# Altium schematic sheet Base Board.SchDoc
size A3; : 輸出入介面電路
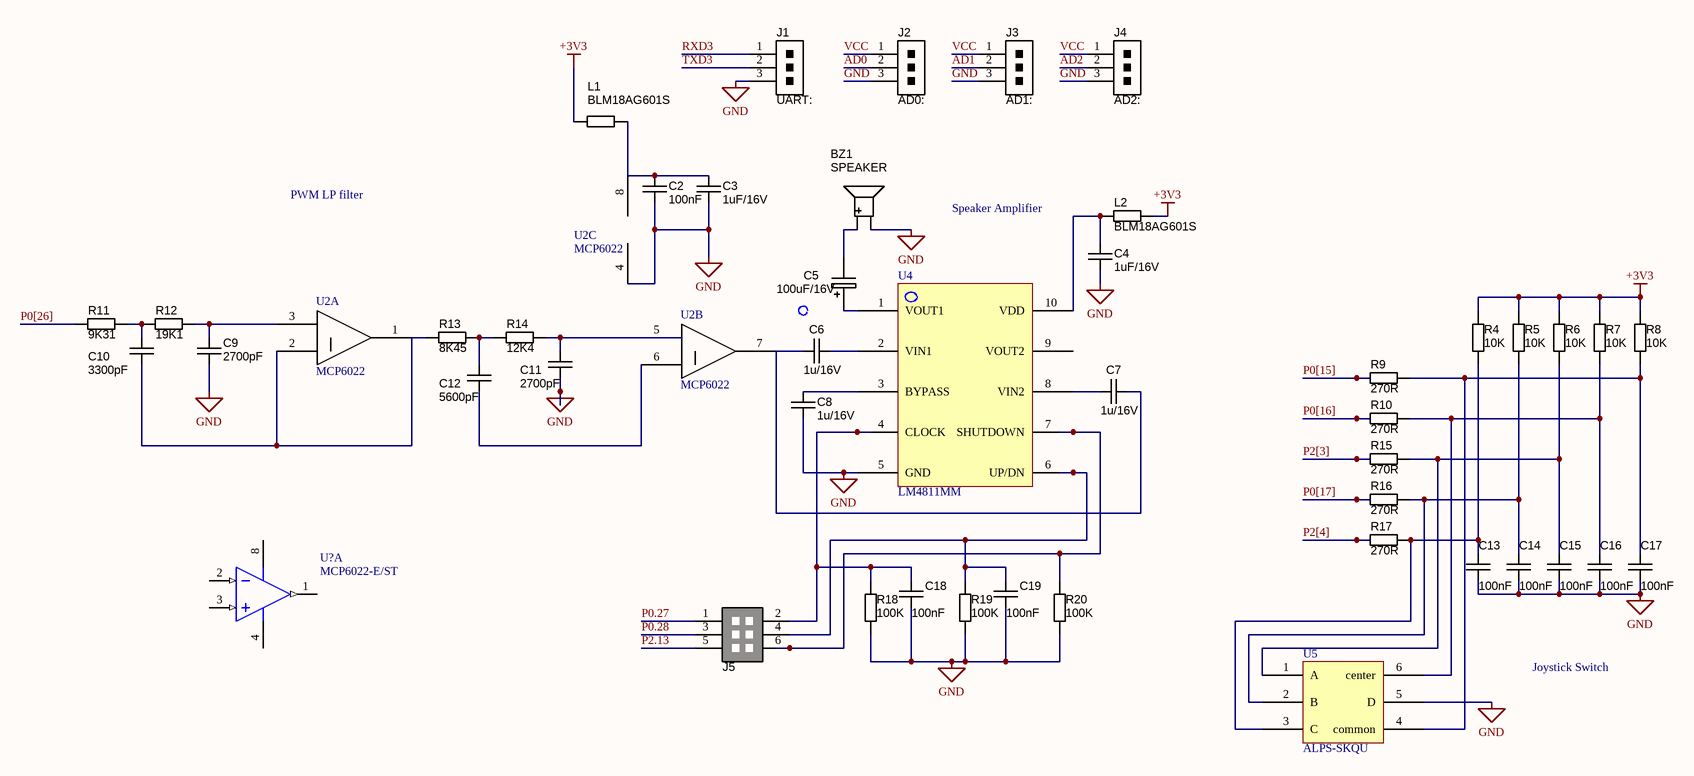
[diagram p0: Base Board.SchDoc]

## Parts
BZ1  Manufacturer Part Number 1: SPEAKER  [BUZZER_12.0X8.5MM]  (hidden comment: Alternate part: 3100-932)
C2  value 100nF  [CAPC2012N]  (hidden comment: approved sub OK)
C3  value 1uF/16V  [CAPC2012N]  (hidden comment: approved sub OK)
C4  value 1uF/16V  [CAPC2012N]  (hidden comment: approved sub OK)
C5  (no value)  [CAPMP3528X210N]
C6  value 1u/16V  [CAPC2012N]  (hidden comment: approved sub OK)
C7  value 1u/16V  [CAPC2012N]  (hidden comment: approved sub OK)
C8  value 1u/16V  [CAPC2012N]  (hidden comment: approved sub OK)
C9  value 2700pF  [CAPC2012N]  (hidden comment: approved sub OK)
C10  value 3300pF  [CAPC2012N]  (hidden comment: approved sub OK)
C11  value 2700pF  [CAPC2012N]  (hidden comment: approved sub OK)
C12  value 5600pF  [CAPC2012N]  (hidden comment: approved sub OK)
C13  value 100nF  [CAPC2012N]  (hidden comment: approved sub OK)
C14  value 100nF  [CAPC2012N]  (hidden comment: approved sub OK)
C15  value 100nF  [CAPC2012N]  (hidden comment: approved sub OK)
C16  value 100nF  [CAPC2012N]  (hidden comment: approved sub OK)
C17  value 100nF  [CAPC2012N]  (hidden comment: approved sub OK)
C18  value 100nF  [CAPC2012N]  (hidden comment: approved sub OK)
C19  value 100nF  [CAPC2012N]  (hidden comment: approved sub OK)
J1  CONN_HEADER_1x3P_0.100in  [1x3POS_HEADER]  (value not drawn)
J2  CONN_HEADER_1x3P_0.100in  [1x3POS_HEADER]  (value not drawn)
J3  CONN_HEADER_1x3P_0.100in  [1x3POS_HEADER]  (value not drawn)
J4  CONN_HEADER_1x3P_0.100in  [1x3POS_HEADER]  (value not drawn)
J5  micro-match socket  [6P_PCB_SOCKET_BRD_MNT_MICRO-MATCH]  (value not drawn)
L1  value BLM18AG601S  [RESC2012N]  (hidden comment: Thick Film)
L2  value BLM18AG601S  [RESC2012N]  (hidden comment: Thick Film)
R4  value 10K  [RESC2012N]  (hidden comment: Thick Film)
R5  value 10K  [RESC2012N]  (hidden comment: Thick Film)
R6  value 10K  [RESC2012N]  (hidden comment: Thick Film)
R7  value 10K  [RESC2012N]  (hidden comment: Thick Film)
R8  value 10K  [RESC2012N]  (hidden comment: Thick Film)
R9  value 270R  [RESC1005N]  (hidden comment: Thick Film)
R10  value 270R  [RESC1005N]  (hidden comment: Thick Film)
R11  value 9K31  [RESC1005N]  (hidden comment: Thick Film)
R12  value 19K1  [RESC1005N]  (hidden comment: Thick Film)
R13  value 8K45  [RESC1005N]  (hidden comment: Thick Film)
R14  value 12K4  [RESC1005N]  (hidden comment: Thick Film)
R15  value 270R  [RESC1005N]  (hidden comment: Thick Film)
R16  value 270R  [RESC1005N]  (hidden comment: Thick Film)
R17  value 270R  [RESC1005N]  (hidden comment: Thick Film)
R18  value 100K  [RESC1005N]  (hidden comment: Thick Film)
R19  value 100K  [RESC1005N]  (hidden comment: Thick Film)
R20  value 100K  [RESC1005N]  (hidden comment: Thick Film)
U2  MCP6022  [MSOP-UA8_L]  (parts A,B,C of 3)
U4  LM4811MM  [MSOP-UN10_N]
U5  ALPS-SKQU  [SOT-23-CH6_L]
U?  MCP6022-E/ST  [TSSOP-ST8_N]  (part A of 2)

## Nets
+3V3: L1.1 L2.2 R4.1 R5.1 R6.1 R7.1 R8.1
GND: BZ1.2(Negative) C2.1 C3.1 C4.1 C8.1 C9.2 C11.2 C13.2 C14.2 C15.2 C16.2 C17.2 C18.2 C19.2 J1.3 J2.3 J3.3 J4.3 R18.1 R19.1 R20.1 U4.5(GND) U5.5(D)
AD0: J2.2
AD1: J3.2
AD2: J4.2
P0.27: J5.1
P0.28: J5.3
P0[15]: R9.1
P0[16]: R10.1
P0[17]: R16.1
P0[26]: R11.1
P2.13: J5.5
P2[3]: R15.1
P2[4]: R17.1
RXD3: J1.1
TXD3: J1.2
VCC: J2.1 J3.1 J4.1
NetBZ1_1: BZ1.1(Positive) C5.2
NetC2_2: C2.2 C3.2 L1.2
NetC4_2: C4.2 L2.1 U4.10(VDD)
NetC5_1: C5.1 U4.1(VOUT1)
NetC6_1: C6.1 C7.2
NetC6_2: C6.2 U4.2(VIN1)
NetC7_1: C7.1 U4.8(VIN2)
NetC8_2: C8.2 U4.3(BYPASS)
NetC9_1: C9.1 R12.2
NetC10_1: C10.1 R11.2 R12.1
NetC10_2: C10.2 R13.2
NetC11_1: C11.1 R14.2 U2.5(VINB+)
NetC12_1: C12.1 R13.1 R14.1
NetC13_1: C13.1 R4.2 R17.2 U5.3(C)
NetC14_1: C14.1 R5.2 R16.2 U5.2(B)
NetC15_1: C15.1 R6.2 R15.2 U5.1(A)
NetC16_1: C16.1 R7.2 R10.2 U5.6(center)
NetC17_1: C17.1 R8.2 R9.2 U5.4(common)
NetC18_1: C18.1 J5.2 R18.2 U4.4(CLOCK)
NetC19_1: C19.1 J5.4 R19.2 U4.6(UP/DN)
NetJ5_6: J5.6 R20.2 U4.7(SHUTDOWN)

Not connected (* = marked no-connect by the designer): C12 2; U2 1(VOUTA) 2(VINA-) 3(VINA+) 4(GND) 6(VINB-) 7(VOUTB) 8(VDD); U4 9(VOUT2); U? 1(VOUTA) 2(VINA-) 3(VINA+) 4(VSS) 8(VDD)

## Notes on the sheet
- PWM LP filter
- Speaker Amplifier
- Joystick Switch
- (in symbol CAPT_100u_1210_6V3) 100uF/16V

## Library data of the parts
BZ1 = BZ_12x8.5x6.5_2kHz: Speaker, Magnetic Transducer; Manufacturer 1: CUI Inc; Ratings: 2048 ?00 Hz; Package / Case: 6.5mm pitch; Material: Noryl SE1-J; Supplier 1: Digi-Key; Supplier Part Number 1: 102-1152-ND
C2-C4 C6-C19 = CAPC_100n_0805: Capacitor SMD Cer 100nF 10% 50V X7R 0805; Manufacturer 1: Kemet; Manufacturer Part Number 1: C0805C104K5RACTU; Tolerance: ?0%; Ratings: 50V; X7R; Material: ceramic; Package / Case: 0805 (2012 metric); Supplier 1: Digi-Key; Supplier Part Number 1: 399-1170-1-ND
C5 = CAPT_100u_1210_6V3: Capacitor SMD Tantalum 100uF 20% 6.3V 1210; Manufacturer 1: AVX Corporation; Manufacturer Part Number 1: TCJB107M006R0045; Tolerance: ?0%; Package / Case: 1210 (3528 Metric); Material: Tantalum; Supplier 1: Digi-Key; Supplier Part Number 1: 478-4711-1-ND
J1-J4 = CONN_HEADER_1x3P_0.100in: Pin Header, THT, Single-row, 2.54mm pitch; Manufacturer 1: 3M; Manufacturer Part Number 1: 929647-09-36-I; Pitch: 0.100" (2.54mm); Value: Single-row, 3 positions; QtyOverride: 0.1; Category: Connectors; Mounting Type: Through Hole; Terminal Block Type: Header, Male Pins, Single; Package / Case: Pin header; 2.54mm pitch
J5 = CONN_SOCKET_2x3P_0.100in_Female: Socket THD 6 POS Double-row 2.54mm pitch; Manufacturer 1: TE Connectivity; Manufacturer Part Number 1: 7-215079-6; Pitch: 0.100" (2.54mm); Value: Double-row, 14 positions; QtyOverride: 1; Connector Type: Receptacle; Number of Positions: 6; Package / Case: Connector header; 2.54mm pitch; Contact Type: Female Socket; Number of Rows: 2; Row Spacing: 0.100" (2.54mm); Contact Mating Length: 0.243" (6.17mm); ComponentLink1URL: http://multimedia.3m.com/mws/mediawebserver?66666UuZjcFSLXTtm8T_oxMcEVuQEcuZgVs6EVs6E666666--; ComponentLink1Description: http://multimedia.3m.com/mws/mediawebserver?66666UuZjcFSLXTtm8T_oxMcEVuQEcuZgVs6EVs6E666666--; Supplier 1: Digi-Key; Supplier Part Number 1: A30729CT-ND
L1 L2 R4-R8 = RES_10K_0805_5%: Resistor SMD chip 10k Ohm 0.125W 5% 0805; Manufacturer 1: Yageo; Manufacturer Part Number 1: RC0805JR-0710KL; Ratings: 1/8 W; Tolerance: ?%; Package / Case: 0805 (2012 metric); Material: Thick Film; Supplier 1: Digi-Key; Supplier Part Number 1: 311-10KARCT-ND
R9-R20 = RES_330R_0402_5%: Resistor SMD chip 330 Ohm 0.063W 5% 0402; Manufacturer 1: Yageo; Manufacturer Part Number 1: RC0402JR-07330RL; Ratings: 1/16 W; Tolerance: ?%; Package / Case: 0402 (1005 Metric); Supplier 1: Digi-Key; Supplier Part Number 1: 311-330JRCT-ND; ComponentLink1URL: http://www.yageo.com/documents/recent/PYu-RC0402_51_RoHS_L_6.pdf; ComponentLink1Description: http://www.yageo.com/documents/recent/PYu-RC0402_51_RoHS_L_6.pdf
U? = MCP6022-E/ST: Rail-to-Rail Input/Output, 10 MHz Operational Amplifier, 8-Pin TSSOP, Extended Temperature; Manufacturer: Microchip; DatasheetVersion: revD, Feb-2009; PackageVersion: revBB, Aug-2009; PackageReference: TSSOP-ST8; PackageDescription: 8-Lead Plastic Thin Shrink Small Outline (ST) - 4.4mm Body [TSSOP]; Supplier 1: Digi-Key; Supplier Part Number 1: MCP6022-E/ST-ND; Supplier 2: Farnell; Supplier Part Number 2: 1840887; Supplier 3: Newark; Supplier Part Number 3: 88H9882; Supplier 4: Mouser; Supplier Part Number 4: 579-MCP6022-E/ST; Mounting Technology: Surface Mount; Code_JEDEC: MO-153; PartNumber: MCP6022-E/ST; ComponentLink1Description: Manufacturer URL; ComponentLink1URL: http://www.microchip.com/; ComponentLink2Description: Datasheet; ComponentLink2URL: http://ww1.microchip.com/downloads/en/DeviceDoc/21685d.pdf; ComponentLink3Description: Package Specification; ComponentLink3URL: http://www.microchip.com/stellent/groups/techpub_sg/documents/packagingspec/en012702.pdf